# Altium schematic sheet [03] - POWER BLOCK DIAGRAM.SchDoc: Power Block Diagram
size 431 x 279 mm; SheetNumber: 3; SheetTotal: 4
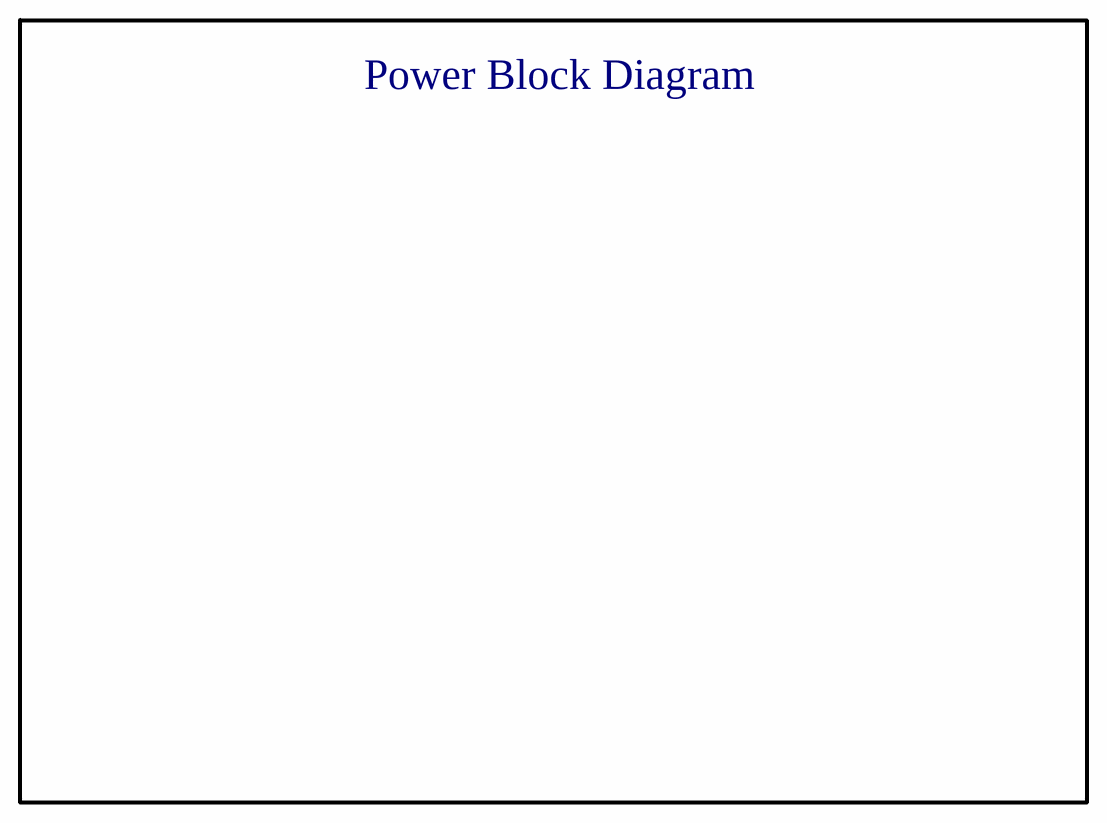
[diagram p0: [03] - POWER BLOCK DIAGRAM.SchDoc]

## Sub-sheets
[04] - SIGNAL BLOCK DIAGRAM = [04] - SIGNAL BLOCK DIAGRAM.SchDoc: no entries

## Notes on the sheet
- Power Block Diagram
- CONFIDENTIALITY NOTICE. THIS DRAWING AND INFORMATION CONTAINED HEREIN ARE THE EXCLUSIVE PROPERTY OF [[COMPANY NAME]] NEITHER THIS DESIGN NOR ANY INFORMATION CONTAINED IN THIS DRAWING MAY BE REPRODUCED OR DISCLOSED WITHOUT THE EXPRESS WRITTEN CONSENT OF [[COMPANY NAME]].
- PCB Part Number:
- PCB Rev.:
- PCB Variant:
- Replaces PCB P/N & Rev.:
- SHEET TITLE:
- SIZE
- B
- Time Stamp:
- Doc. No.:
- Doc. Rev.:
- Doc. Status:
- Sheet
- of